# Altium schematic sheet PIC32.SchDoc
size A
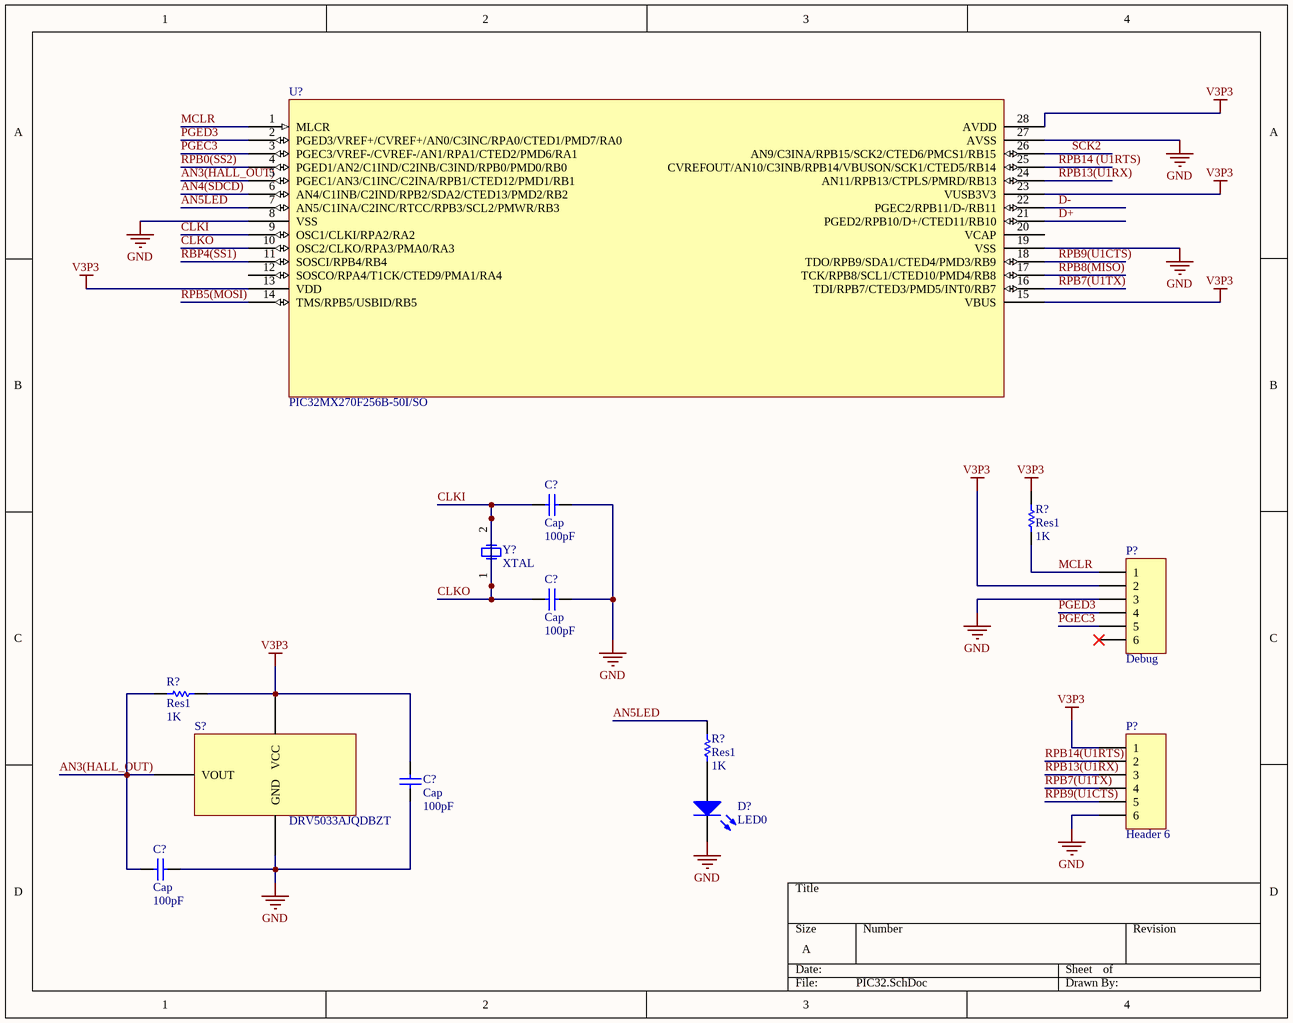
[diagram p0: PIC32.SchDoc]

## Parts
(Parts that share a designator on the sheet are numbered #1, #2 ... from top to bottom, then left to right.)
C?#1  Cap  value 100pF  [RAD-0.3]
C?#2  Cap  value 100pF  [RAD-0.3]
C?#3  Cap  value 100pF  [RAD-0.3]
C?#4  Cap  value 100pF  [RAD-0.3]
D?  LED0  [LED-0]
P?#1  Debug  [HDR1X6]
P?#2  Header 6  [HDR1X6]
R?#1  Res1  value 1K  [AXIAL-0.3]
R?#2  Res1  value 1K  [AXIAL-0.3]
R?#3  Res1  value 1K  [AXIAL-0.3]
S?  DRV5033AJQDBZT
U?  PIC32MX270F256B-50I/SO
Y?  XTAL  [R38]

## Nets
GND: C?#1.2 C?#2.2 C?#3.1 C?#4.2 D?.2(K) P?#1.3 P?#2.6 S?.30(GND) U?.8(VSS) U?.19(VSS) U?.27(AVSS)
V3P3: C?#3.2 P?#1.2 P?#2.1 R?#1.1 R?#2.2 S?.32(VCC) U?.13(VDD) U?.15(VBUS) U?.23(VUSB3V3) U?.28(AVDD)
AN3(HALL_OUT): C?#4.1 R?#2.1 S?.31(VOUT) U?.5(PGEC1/AN3/C1INC/C2INA/RPB1/CTED12/PMD1/RB1)
AN4(SDCD): U?.6(AN4/C1INB/C2IND/RPB2/SDA2/CTED13/PMD2/RB2)
AN5LED: R?#3.2 U?.7(AN5/C1INA/C2INC/RTCC/RPB3/SCL2/PMWR/RB3)
CLKI: C?#1.1 C?#2.1 U?.9(OSC1/CLKI/RPA2/RA2) U?.10(OSC2/CLKO/RPA3/PMA0/RA3) Y?.1(OSC1) Y?.2(OSC2)  [also labelled CLKO]
D+: U?.21(PGED2/RPB10/D+/CTED11/RB10)
D-: U?.22(PGEC2/RPB11/D-/RB11)
MCLR: P?#1.1 R?#1.2 U?.1(MLCR)
PGEC3: P?#1.5 U?.3(PGEC3/VREF-/CVREF-/AN1/RPA1/CTED2/PMD6/RA1)
PGED3: P?#1.4 U?.2(PGED3/VREF+/CVREF+/AN0/C3INC/RPA0/CTED1/PMD7/RA0)
RBP4(SS1): U?.11(SOSCI/RPB4/RB4)
RPB0(SS2): U?.4(PGED1/AN2/C1IND/C2INB/C3IND/RPB0/PMD0/RB0)
RPB5(MOSI): U?.14(TMS/RPB5/USBID/RB5)
RPB7(U1TX): P?#2.4 U?.16(TDI/RPB7/CTED3/PMD5/INT0/RB7)
RPB8(MISO): U?.17(TCK/RPB8/SCL1/CTED10/PMD4/RB8)
RPB9(U1CTS): P?#2.5 U?.18(TDO/RPB9/SDA1/CTED4/PMD3/RB9)
RPB13(U1RX): P?#2.3 U?.24(AN11/RPB13/CTPLS/PMRD/RB13)
RPB14 (U1RTS): U?.25(CVREFOUT/AN10/C3INB/RPB14/VBUSON/SCK1/CTED5/RB14)
RPB14(U1RTS): P?#2.2
SCK2: U?.26(AN9/C3INA/RPB15/SCK2/CTED6/PMCS1/RB15)
NetD?_1: D?.1(A) R?#3.1

Not connected (* = marked no-connect by the designer): P?#1 6*; U? 12(SOSCO/RPA4/T1CK/CTED9/PMA1/RA4) 20(VCAP)

## Library data of the parts
C?#1-C?#4 = Cap: Capacitor; Published: 8-Jun-2000; LatestRevisionDate: 17-Jul-2002; LatestRevisionNote: Re-released for DXP Platform.; PackageReference: RAD-0.3; Publisher: Altium Limited; PackageDescription: Radial Cap, Thru-Hole; 2 Leads; 0.3 in Pin Spacing
D? = LED0: Typical INFRARED GaAs LED; Published: 8-Jun-2000; LatestRevisionDate: 08-Jul-2005; LatestRevisionNote: Mech Layer 1 removed.; PackageReference: LED-0; Publisher: Altium Limited; PackageDescription: LED; 2 Leads
P?#1 P?#2 = Header 6: Header, 6-Pin; LatestRevisionDate: 17-Jul-2002; LatestRevisionNote: Re-released for DXP Platform.; Publisher: Altium Limited
R?#1-R?#3 = Res1: Resistor; Published: 8-Jun-2000; LatestRevisionDate: 17-Jul-2002; LatestRevisionNote: Re-released for DXP Platform.; PackageReference: AXIAL-0.3; Publisher: Altium Limited; PackageDescription: Axial Device, Thru-Hole; 2 Leads; 0.3 in Pin Spacing
Y? = XTAL: Crystal Oscillator; Published: 8-Jun-2000; LatestRevisionDate: 17-Jul-2002; LatestRevisionNote: Re-released for DXP Platform.; PackageReference: R38; Publisher: Altium Limited; PackageDescription: Crystal, Thru-Hole; 2 Leads; Body 3.1 x 8.2 mm (Dia.xH)